# Altium schematic sheet M2_DRV8301_driver.SchDoc
size 594 x 420 mm; SheetNumber: 6; SheetTotal: 9
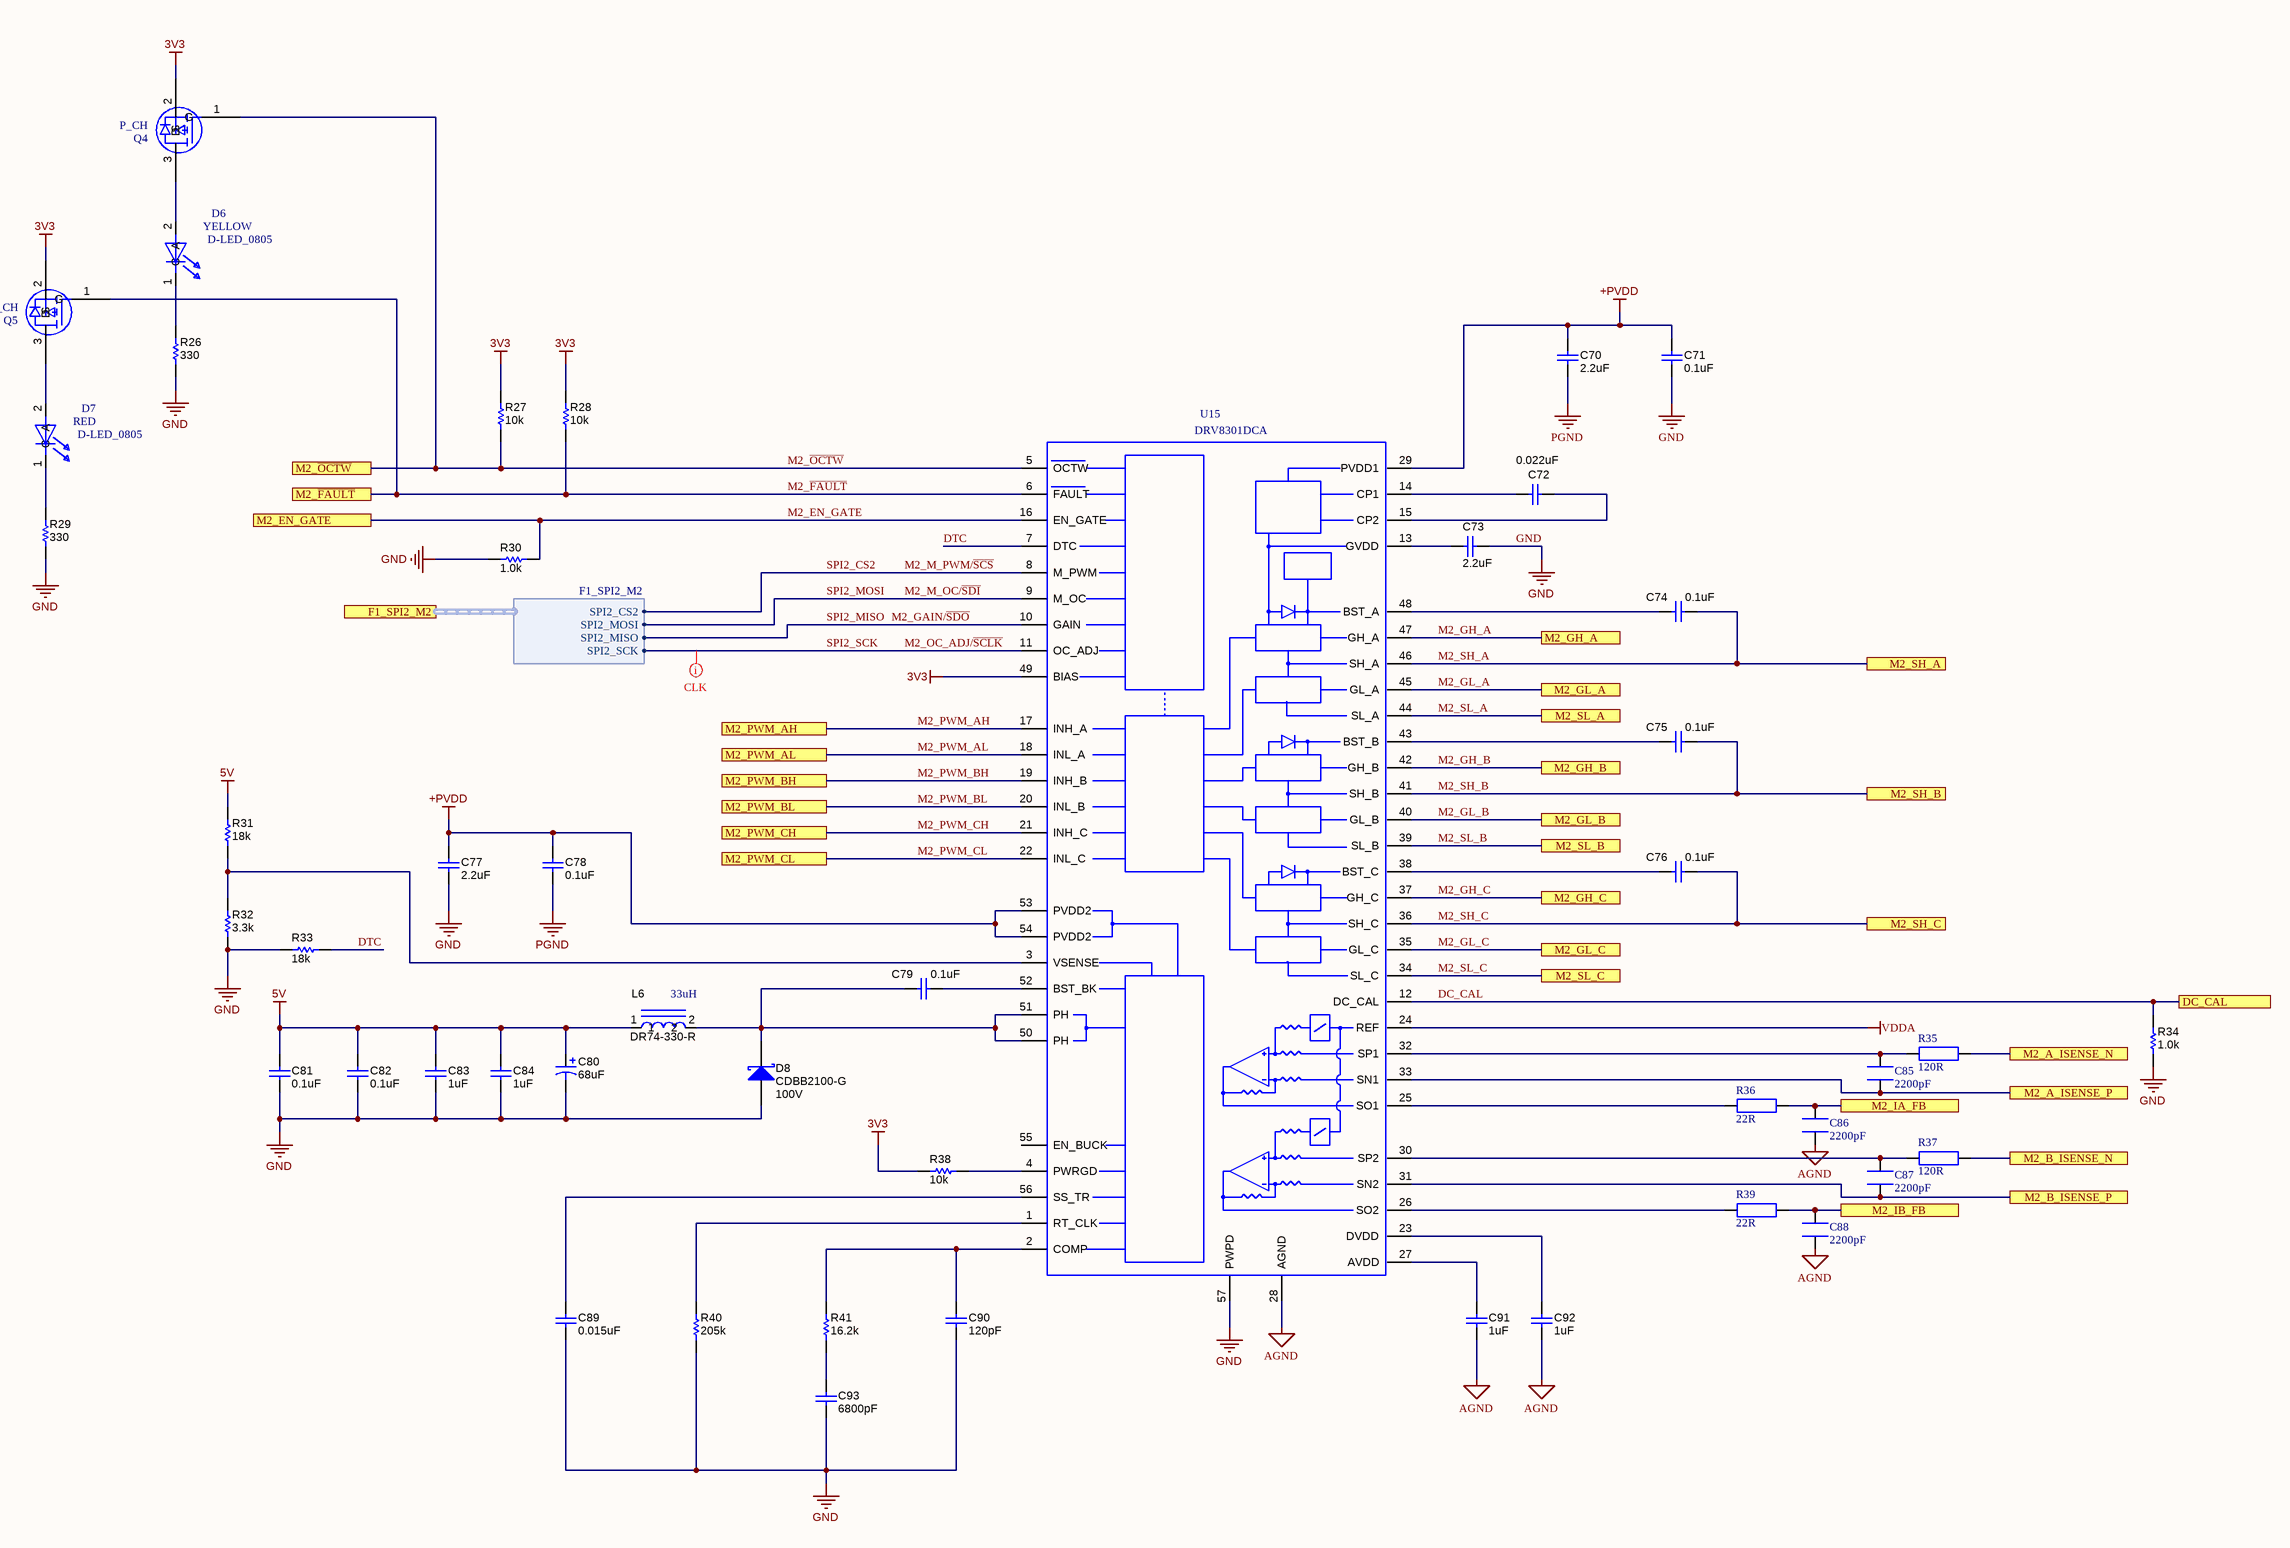
[diagram p0: M2_DRV8301_driver.SchDoc]

## Parts
C70  ValueDisplayed: 2.2uF  [1210L]  (hidden comment: GRM32ER72A225KA35L)
C71  ValueDisplayed: 0.1uF  [0603L]  (hidden comment: GRM188R72A104KA35D)
C72  ValueDisplayed: 0.022uF  [0603L]  (hidden comment: C1608X7R1H223K)
C73  ValueDisplayed: 2.2uF  [0805L]  (hidden comment: GRM219R61E225KA12D)
C74  ValueDisplayed: 0.1uF  [0603L]  (hidden comment: C1608X7R1H104K)
C75  ValueDisplayed: 0.1uF  [0603L]  (hidden comment: C1608X7R1H104K)
C76  ValueDisplayed: 0.1uF  [0603L]  (hidden comment: C1608X7R1H104K)
C77  ValueDisplayed: 2.2uF  [1210L]  (hidden comment: GRM32ER72A225KA35L)
C78  ValueDisplayed: 0.1uF  [0603L]  (hidden comment: GRM188R72A104KA35D)
C79  ValueDisplayed: 0.1uF  [0603L]  (hidden comment: C1608X7R1H104K)
C80  ValueDisplayed: 68uF  [SM_RADIAL_D]  (hidden comment: EEE-FK1E470P)
C81  ValueDisplayed: 0.1uF  [0603L]  (hidden comment: C1608X7R1E104K)
C82  ValueDisplayed: 0.1uF  [0603L]  (hidden comment: C1608X7R1E104K)
C83  ValueDisplayed: 1uF  [0603L]  (hidden comment: C1608X5R1E105K080AC)
C84  ValueDisplayed: 1uF  [0603L]  (hidden comment: C1608X5R1E105K080AC)
C85  2200pF  [CAPC1608X09L]
C86  2200pF  [CAPC1608X09L]
C87  2200pF  [CAPC1608X09L]
C88  2200pF  [CAPC1608X09L]
C89  ValueDisplayed: 0.015uF  [0603L]  (hidden comment: GRM188R71H153KA01D)
C90  ValueDisplayed: 120pF  [0603L]  (hidden comment: GRM1885C1H121JA01D)
C91  ValueDisplayed: 1uF  [0603L]  (hidden comment: GRM188R61E105KA12D)
C92  ValueDisplayed: 1uF  [0603L]  (hidden comment: GRM188R61E105KA12D)
C93  ValueDisplayed: 6800pF  [0603L]  (hidden comment: GRM188R71H682KA01D)
D6  D-LED_0805  value YELLOW  [LED_0805]
D7  D-LED_0805  value RED  [LED_0805]
D8  CDBB2100-G  value 100V  [SMB]
L6  DR74-330-R  value 33uH  [IND_DR74]
Q4  value P_CH  [SOT-23]  (hidden comment: TR_PFET_SOT23)
Q5  value P_CH  [SOT-23]  (hidden comment: TR_PFET_SOT23)
R26  value 330  [0603L]  (hidden comment: CRCW0603330RJNEA)
R27  value 10k  [0603L]  (hidden comment: CRCW060310K0JNEA)
R28  value 10k  [0603L]  (hidden comment: CRCW060310K0JNEA)
R29  value 330  [0603L]  (hidden comment: CRCW0603330RJNEA)
R30  value 1.0k  [0603L]  (hidden comment: CRCW06031K00JNEA)
R31  value 18k  [0603L]  (hidden comment: CRCW060331K6FKEA)
R32  value 3.3k  [0603L]  (hidden comment: RG1608P-103-B-T5)
R33  value 18k  [0603L]  (hidden comment: CRCW060331K6FKEA)
R34  value 1.0k  [0603L]  (hidden comment: CRCW06031K00JNEA)
R35  120R  [RESC1608X55N]
R36  22R  [RESC1608X55N]
R37  120R  [RESC1608X55N]
R38  value 10k  [0603L]  (hidden comment: CRCW060310K0JNEA)
R39  22R  [RESC1608X55N]
R40  value 205k  [0603L]  (hidden comment: CRCW0603205KFKEA)
R41  value 16.2k  [0603L]  (hidden comment: CRCW060316K2FKEA)
U15  DRV8301DCA  [DCA_56P]

## Ports
DC_CAL (see STM32G4_DRV8301_hardware_TOP_V1.0[4C], M1_DRV8301_driver[7D], STM32G4_microcontroller[3B]), F1_SPI2_M2 (harness F1_SPI2_M2, see STM32G4_DRV8301_hardware_TOP_V1.0[4B], STM32F1_microcontroller[6B]), M2_A_ISENSE_N (see STM32G4_DRV8301_hardware_TOP_V1.0[5C], DRV8301_inverter[1F]), M2_A_ISENSE_P (see STM32G4_DRV8301_hardware_TOP_V1.0[5C], DRV8301_inverter[1F]), M2_B_ISENSE_N (see STM32G4_DRV8301_hardware_TOP_V1.0[5C], DRV8301_inverter[4F]), M2_B_ISENSE_P (see STM32G4_DRV8301_hardware_TOP_V1.0[5C], DRV8301_inverter[4F]), M2_EN_GATE (see STM32G4_DRV8301_hardware_TOP_V1.0[4C]), M2_GH_A (see STM32G4_DRV8301_hardware_TOP_V1.0[5B], DRV8301_inverter[2D]), M2_GH_B (see STM32G4_DRV8301_hardware_TOP_V1.0[5B], DRV8301_inverter[4D]), M2_GH_C (see STM32G4_DRV8301_hardware_TOP_V1.0[5C], DRV8301_inverter[6D]), M2_GL_A (see STM32G4_DRV8301_hardware_TOP_V1.0[5B], DRV8301_inverter[2E]), M2_GL_B (see STM32G4_DRV8301_hardware_TOP_V1.0[5B], DRV8301_inverter[4E]), M2_GL_C (see STM32G4_DRV8301_hardware_TOP_V1.0[5C], DRV8301_inverter[6E]), M2_IA_FB (see STM32G4_DRV8301_hardware_TOP_V1.0[4C]), M2_IB_FB (see STM32G4_DRV8301_hardware_TOP_V1.0[4C]), M2_PWM_AH (see STM32G4_DRV8301_hardware_TOP_V1.0[4C]), M2_PWM_AL (see STM32G4_DRV8301_hardware_TOP_V1.0[4C]), M2_PWM_BH (see STM32G4_DRV8301_hardware_TOP_V1.0[4C]), M2_PWM_BL (see STM32G4_DRV8301_hardware_TOP_V1.0[4C]), M2_PWM_CH (see STM32G4_DRV8301_hardware_TOP_V1.0[4C]), M2_PWM_CL (see STM32G4_DRV8301_hardware_TOP_V1.0[4C]), M2_SH_A (see STM32G4_DRV8301_hardware_TOP_V1.0[5B], DRV8301_inverter[2E], DRV8301_inverter[7E]), M2_SH_B (see STM32G4_DRV8301_hardware_TOP_V1.0[5B], DRV8301_inverter[5E], DRV8301_inverter[7E]), M2_SH_C (see STM32G4_DRV8301_hardware_TOP_V1.0[5C], DRV8301_inverter[7D], DRV8301_inverter[7E]), M2_SL_A (see STM32G4_DRV8301_hardware_TOP_V1.0[5B], DRV8301_inverter[2F]), M2_SL_B (see STM32G4_DRV8301_hardware_TOP_V1.0[5B], DRV8301_inverter[5F]), M2_SL_C (see STM32G4_DRV8301_hardware_TOP_V1.0[5C], DRV8301_inverter[7F]), M2_~{FAULT} (see STM32G4_DRV8301_hardware_TOP_V1.0[4B]), M2_~{OCTW} (see STM32G4_DRV8301_hardware_TOP_V1.0[4B])

## Harnesses
F1_SPI2_M2: SPI2_SCK, SPI2_MISO, SPI2_MOSI, SPI2_CS2

## Nets
3V3: Q4.2(S) Q5.2(S) R27.2 R28.2 R38.2 U15.49(BIAS)
5V: C80.1(+) C81.1 C82.1 C83.1 C84.1 L6.1 R31.2
+PVDD: C70.1 C71.1 C77.1 C78.1 U15.29(PVDD1) U15.53(PVDD2) U15.54(PVDD2)
AGND: C86.2 C88.2 C91.2 C92.2 U15.28(AGND)
GND: C71.2 C73.2 C77.2 C80.2(-) C81.2 C82.2 C83.2 C84.2 C89.2 C90.2 C93.2 D8.2(A) R26.1 R29.1 R30.1 R32.1 R33.2 R34.1 R40.1 U15.57(PWPD)
PGND: C70.2 C78.2
VDDA: U15.24(REF)
DC_CAL: R34.2 U15.12(DC_CAL) ; port DC_CAL
DTC: R33.1 U15.7(DTC)
M2_A_ISENSE_N: R35.1 ; port M2_A_ISENSE_N
M2_A_ISENSE_P: C85.2 U15.33(SN1) ; port M2_A_ISENSE_P
M2_B_ISENSE_N: R37.1 ; port M2_B_ISENSE_N
M2_B_ISENSE_P: C87.2 U15.31(SN2) ; port M2_B_ISENSE_P
M2_EN_GATE: R30.2 U15.16(EN_GATE) ; port M2_EN_GATE
M2_~{FAULT}: Q5.1(G) R28.1 U15.6(FAULT) ; port M2_~{FAULT}
M2_GAIN/~{SDO}: U15.10(GAIN) ; port F1_SPI2_M2.SPI2_MISO  [also labelled SPI2_MISO]
M2_GH_A: U15.47(GH_A) ; port M2_GH_A
M2_GH_B: U15.42(GH_B) ; port M2_GH_B
M2_GH_C: U15.37(GH_C) ; port M2_GH_C
M2_GL_A: U15.45(GL_A) ; port M2_GL_A
M2_GL_B: U15.40(GL_B) ; port M2_GL_B
M2_GL_C: U15.35(GL_C) ; port M2_GL_C
M2_IA_FB: C86.1 R36.1 ; port M2_IA_FB
M2_IB_FB: C88.1 R39.1 ; port M2_IB_FB
M2_M_OC/~{SDI}: U15.9(M_OC) ; port F1_SPI2_M2.SPI2_MOSI  [also labelled SPI2_MOSI]
M2_M_PWM/~{SCS}: U15.8(M_PWM) ; port F1_SPI2_M2.SPI2_CS2  [also labelled SPI2_CS2]
M2_~{OCTW}: Q4.1(G) R27.1 U15.5(OCTW) ; port M2_~{OCTW}
M2_OC_ADJ/~{SCLK}: U15.11(OC_ADJ) ; port F1_SPI2_M2.SPI2_SCK  [also labelled SPI2_SCK]
M2_PWM_AH: U15.17(INH_A) ; port M2_PWM_AH
M2_PWM_AL: U15.18(INL_A) ; port M2_PWM_AL
M2_PWM_BH: U15.19(INH_B) ; port M2_PWM_BH
M2_PWM_BL: U15.20(INL_B) ; port M2_PWM_BL
M2_PWM_CH: U15.21(INH_C) ; port M2_PWM_CH
M2_PWM_CL: U15.22(INL_C) ; port M2_PWM_CL
M2_SH_A: C74.2 U15.46(SH_A) ; port M2_SH_A
M2_SH_B: C75.2 U15.41(SH_B) ; port M2_SH_B
M2_SH_C: C76.2 U15.36(SH_C) ; port M2_SH_C
M2_SL_A: U15.44(SL_A) ; port M2_SL_A
M2_SL_B: U15.39(SL_B) ; port M2_SL_B
M2_SL_C: U15.34(SL_C) ; port M2_SL_C
NetC72_1: C72.1 U15.14(CP1)
NetC72_2: C72.2 U15.15(CP2)
NetC73_1: C73.1 U15.13(GVDD)
NetC74_1: C74.1 U15.48(BST_A)
NetC75_1: C75.1 U15.43(BST_B)
NetC76_1: C76.1 U15.38(BST_C)
NetC79_1: C79.1 D8.1(K) L6.2 U15.50(PH) U15.51(PH)
NetC79_2: C79.2 U15.52(BST_BK)
NetC85_1: C85.1 R35.2 U15.32(SP1)
NetC87_1: C87.1 R37.2 U15.30(SP2)
NetC89_1: C89.1 U15.56(SS_TR)
NetC90_1: C90.1 R41.2 U15.2(COMP)
NetC91_1: C91.1 U15.27(AVDD)
NetC92_1: C92.1 U15.23(DVDD)
NetC93_1: C93.1 R41.1
NetD6_1: D6.1(C) R26.2
NetD6_2: D6.2(A) Q4.3(D)
NetD7_1: D7.1(C) R29.2
NetD7_2: D7.2(A) Q5.3(D)
NetR31_1: R31.1 R32.2 U15.3(VSENSE)
NetR36_2: R36.2 U15.25(SO1)
NetR38_1: R38.1 U15.4(PWRGD)
NetR39_2: R39.2 U15.26(SO2)
NetR40_2: R40.2 U15.1(RT_CLK)

Not connected (* = marked no-connect by the designer): U15 55(EN_BUCK)

## Layout directives
mark named CLK: M2_OC_ADJ/~{SCLK}

## Notes on the sheet
- DWG NO:
- REV:
- THIS DOCUMENT AND THE DATA DISCLOSED HEREIN OR
- HEREWITH IS THE PROPERTY OF ALTIUM LIMITED AND MAY
- BE FREELY DISTRIBUTED IN WHOLE. NO RIGHTS ARE
- RESERVED OR EXPRESS OR IMPLIED WARANTEE GIVEN.
- REVISION
- DESCRIPTION
- DATE
- APPROVED
- ENG:
- APPROVALS
- PROJECT
- DSN:
- CHK:
- REFERENCE DOCUMENTS
- PROJECT REVISION:
- TITLE
- DOCUMENT REVISION:
- DESIGN ITEM:
- BOM:
- FAB DWG:
- PCB DWG:
- ASSY DWG:
- SCALE:
- A2
- SIZE
- CAGE CODE
- FILE NAME
- DWG NO.
- SHEET
- OF
- REV

## Library data of the parts
C70 C77 = GRM32ER72A225KA35L: CAP, CERM, 2.2uF, 100V, +/-10%, X7R, 1210; Manufacturer: MuRata; Polarized: N; CompType: Capacitor; U/M: EA; Cap_F: 0.0000022; Tolerance_%: 10; ESR_Ohm: 0.007; Value1: 0.007 ohm; VDC_V: 100; IRMS_A: 4.4; TaMin_C: -55; TaMax_C: 125; Cap_Case: 1210; SymbolVersion: 2008-07-09; Value: 2.2uF; PartNumber: GRM32ER72A225KA35L; PackageReference: 1210; RoHS: Y; Value2: 100V; MountType: SMT; Technology: Ceramic; TempCo: X7R; Published: 2008-06-19; Publisher: Texas Instruments; LatestRevisionDate: 2013-05-24; LatestRevisionNote: Changed publisher; ComponentLink1Description: Datasheet link; ComponentLink1URL: http://search.murata.co.jp/Ceramy/PnsearchViewAction.do?HnOFG=ON&HnNFG=ON&SEL_CNT=50&sLang=en&sKey=GRM32ER72A225KA35L&x=9&y=9&search=startwith; Supplier 1: Digi-Key; Supplier Part Number 1: 490-3385-1-ND; Supplier 2: Mouser; Supplier Part Number 2: 81-GRM32ER72A225KA35; Supplier 3: Farnell; Supplier Part Number 3: 1735547
C71 C78 = GRM188R72A104KA35D: CAP, CERM, 0.1uF, 100V, +/-10%, X7R, 0603; Manufacturer: MuRata; Polarized: N; CompType: Capacitor; U/M: EA; Cap_F: 0.0000001; Tolerance_%: 10; Value1: Unknown; VDC_V: 100; TaMin_C: -55; TaMax_C: 125; Cap_Case: 0603; SymbolVersion: 2008-07-09; Value: 0.1uF; PartNumber: GRM188R72A104KA35D; PackageReference: 0603; RoHS: Y; Value2: 100V; MountType: SMT; Technology: Ceramic; TempCo: X7R; Published: 2008-06-19; Publisher: Texas Instruments; LatestRevisionDate: 2013-05-24; LatestRevisionNote: Changed publisher; ComponentLink1Description: Datasheet link; ComponentLink1URL: http://search.murata.co.jp/Ceramy/PnsearchViewAction.do?HnOFG=ON&HnNFG=ON&SEL_CNT=50&sLang=en&sKey=GRM188R72A104KA35D&x=9&y=9&search=startwith; Supplier 1: Digi-Key; Supplier Part Number 1: 490-3285-1-ND; Supplier 2: Mouser; Supplier Part Number 2: 81-GRM188R72A104KA35; Supplier 3: Farnell; Supplier Part Number 3: 1828921
C72 = C1608X7R1H223K: CAP, CERM, 0.022uF, 50V, +/-10%, X7R, 0603; Manufacturer: TDK; Polarized: N; CompType: Capacitor; U/M: EA; Cap_F: 0.000000022; Tolerance_%: 10; ESR_Ohm: 0.0383; Value1: 0.0383 ohm; VDC_V: 50; TaMin_C: -55; TaMax_C: 125; Cap_Case: 0603; SymbolVersion: 2008-07-09; Value: 0.022uF; PartNumber: C1608X7R1H223K; PackageReference: 0603; RoHS: Y; Value2: 50V; MountType: SMT; Technology: Ceramic; TempCo: X7R; Published: 2008-06-19; Publisher: Texas Instruments; LatestRevisionDate: 2013-05-24; LatestRevisionNote: Changed publisher; ComponentLink1Description: Datasheet link; ComponentLink1URL: http://www.tdk.co.jp/tefe02/e412_c.pdf; Supplier 1: Digi-Key; Supplier Part Number 1: 445-1312-1-ND; Supplier 2: Farnell; Supplier Part Number 2: 1907316
C73 = GRM219R61E225KA12D: CAP, CERM, 2.2uF, 25V, +/-10%, X5R, 0805; Manufacturer: MuRata; Polarized: N; CompType: Capacitor; U/M: EA; Cap_F: 0.0000022; Tolerance_%: 10; ESR_Ohm: 0.006; Value1: 0.006 ohm; VDC_V: 25; TaMin_C: -55; TaMax_C: 85; Cap_Case: 0805; SymbolVersion: 2008-07-09; Value: 2.2uF; PartNumber: GRM219R61E225KA12D; PackageReference: 0805; RoHS: Y; Value2: 25V; MountType: SMT; Technology: Ceramic; TempCo: X5R; Published: 2008-06-19; Publisher: Texas Instruments; LatestRevisionDate: 2013-05-24; LatestRevisionNote: Changed publisher; ComponentLink1Description: Datasheet link; ComponentLink1URL: http://search.murata.co.jp/Ceramy/PnsearchViewAction.do?HnOFG=ON&HnNFG=ON&SEL_CNT=50&sLang=en&sKey=GRM219R61E225KA12D&x=9&y=9&search=startwith; Supplier 1: Digi-Key; Supplier Part Number 1: 490-1701-1-ND; Supplier 2: Mouser; Supplier Part Number 2: 81-GRM219R61E225K; Supplier 3: Farnell; Supplier Part Number 3: 1845749
C74-C76 C79 = C1608X7R1H104K: CAP, CERM, 0.1uF, 50V, +/-10%, X7R, 0603; Manufacturer: TDK; Polarized: N; CompType: Capacitor; U/M: EA; Cap_F: 0.0000001; Tolerance_%: 10; ESR_Ohm: 0.017; Value1: 0.017 ohm; VDC_V: 50; TaMin_C: -55; TaMax_C: 125; Cap_Case: 0603; SymbolVersion: 2008-07-09; Value: 0.1uF; PartNumber: C1608X7R1H104K; PackageReference: 0603; RoHS: Y; Value2: 50V; MountType: SMT; Technology: Ceramic; TempCo: X7R; Published: 2008-06-19; Publisher: Texas Instruments; LatestRevisionDate: 2013-05-24; LatestRevisionNote: Changed publisher; ComponentLink1Description: Datasheet link; ComponentLink1URL: http://www.tdk.co.jp/tefe02/e412_c.pdf; Supplier 1: Digi-Key; Supplier Part Number 1: 445-1314-1-ND; Supplier 2: Farnell; Supplier Part Number 2: 1118182
C80 = EEE-FK1E470P: CAP, AL, 47uF, 25V, +/-20%, 0.36 ohm, SMD; Manufacturer: Panasonic; Polarized: Y; CompType: Capacitor; U/M: EA; Cap_F: 0.000047; Tolerance_%: 20; VDC_V: 25; ESR_Ohm: 0.36; IRMS_A: 0.24; TaMin_C: -55; TaMax_C: 105; Cap_Case: D; SymbolVersion: 2008-07-09; Value: 47uF; PartNumber: EEE-FK1E470P; PackageReference: SMT Radial D; RoHS: Y; Value1: 0.36 ohm; Value2: 25V; MountType: SMT; Technology: AL; Series: FK; Publisher: Texas Instruments; LatestRevisionDate: 2013-05-31; ComponentLink1Description: Datasheet link; ComponentLink1URL: http://www.panasonic.com/industrial/components/pdf/smt_aec_050505.pdf; Supplier 1: Digi-Key; Supplier Part Number 1: PCE3804CT-ND; Supplier 2: Mouser; Supplier Part Number 2: 667-EEE-FK1E470P; Supplier 3: Farnell; Supplier Part Number 3: 9695753
C81 C82 = C1608X7R1E104K: CAP, CERM, 0.1uF, 25V, +/-10%, X7R, 0603; Manufacturer: TDK; Polarized: N; CompType: Capacitor; U/M: EA; Cap_F: 0.0000001; Tolerance_%: 10; ESR_Ohm: 0.017; Value1: 0.017 ohm; VDC_V: 25; TaMin_C: -55; TaMax_C: 125; Cap_Case: 0603; SymbolVersion: 2008-07-09; Value: 0.1uF; PartNumber: C1608X7R1E104K; PackageReference: 0603; RoHS: Y; Value2: 25V; MountType: SMT; Technology: Ceramic; TempCo: X7R; Published: 2008-06-19; Publisher: Texas Instruments; LatestRevisionDate: 2013-05-24; LatestRevisionNote: Changed publisher; ComponentLink1Description: Datasheet link; ComponentLink1URL: http://www.tdk.co.jp/tefe02/e412_c.pdf; Supplier 1: Digi-Key; Supplier Part Number 1: 445-1316-1-ND; Supplier 2: Farnell; Supplier Part Number 2: 1844230
C83 C84 = C1608X5R1E105K080AC: CAP, CERM, 1uF, 25V, +/-10%, X5R, 0603; Manufacturer: TDK; Polarized: N; CompType: Capacitor; U/M: EA; Cap_F: 0.000001; Tolerance_%: 10; Value1: Unknown; VDC_V: 25; TaMin_C: -55; TaMax_C: 85; Cap_Case: 0603; SymbolVersion: 2008-07-09; Value: 1uF; PartNumber: C1608X5R1E105K080AC; PackageReference: 0603; RoHS: Y; Value2: 25V; MountType: SMT; Technology: Ceramic; TempCo: X5R; Published: 2008-06-19; Publisher: Texas Instruments; LatestRevisionDate: 2013-05-24; LatestRevisionNote: Changed publisher; ComponentLink1Description: Datasheet link; ComponentLink1URL: http://product.tdk.com/capacitor/mlcc/en/documents/mlcc_commercial_general_en.pdf; Supplier 1: Digi-Key; Supplier Part Number 1: 445-5146-1-ND; Supplier 2: Newark; Supplier Part Number 2: 90R7677
C85-C88 = GRM1885C1H222JA01D: CAP CER 2200PF 50V NP0 0603; Manufacturer: Murata Electronics North America; Tolerance: ±5%; Temperature Coefficient: C0G, NP0; Supplier 1: Digi-Key; Supplier Part Number 1: 490-1459-1-ND; RoHS: RoHS Compliant; Category: Capacitors; Stock 1: 850589; Pricing 1: 1=0.11, 10=0.08, 25=0.058, 50=0.0434, 100=0.0355, 250=0.02972, 500=0.02536, 1000=0.01992 (USD); Packaging: Cut Tape (CT); Capacitance: 2200pF; Voltage - Rated: 50V; Mounting Type: Surface Mount, MLCC; Operating Temperature: -55°C ~ 125°C; Applications: General Purpose; Ratings: -; Package / Case: 0603 (1608 Metric); Size / Dimension: 0.063" L x 0.031" W (1.60mm x 0.80mm); Height - Seated (Max): -; Thickness (Max): 0.035" (0.90mm); Lead Spacing: -; Features: -; Lead Style: -; ComponentLink1URL: http://www.murata.com/~/media/webrenewal/support/library/catalog/products/capacitor/mlcc/c02e.ashx; ComponentLink1Description: http://www.murata.com/~/media/webrenewal/support/library/catalog/products/capacitor/mlcc/c02e.ashx; Part Status: Active
C89 = GRM188R71H153KA01D: CAP, CERM, 0.015uF, 50V, +/-10%, X7R, 0603; Manufacturer: MuRata; Polarized: N; CompType: Capacitor; U/M: EA; Cap_F: 0.000000015; Tolerance_%: 10; Value1: Unknown; VDC_V: 50; TaMin_C: -55; TaMax_C: 125; Cap_Case: 0603; SymbolVersion: 2008-07-09; Value: 0.015uF; PartNumber: GRM188R71H153KA01D; PackageReference: 0603; RoHS: Y; Value2: 50V; MountType: SMT; Technology: Ceramic; TempCo: X7R; Published: 2008-06-19; Publisher: Texas Instruments; LatestRevisionDate: 2013-05-24; LatestRevisionNote: Changed publisher; ComponentLink1Description: Datasheet link; ComponentLink1URL: http://search.murata.co.jp/Ceramy/PnsearchViewAction.do?HnOFG=ON&HnNFG=ON&SEL_CNT=50&sLang=en&sKey=GRM188R71H153KA01D&x=9&y=9&search=startwith; Supplier 1: Digi-Key; Supplier Part Number 1: 490-1514-1-ND; Supplier 2: Mouser; Supplier Part Number 2: 81-GRM18R71H153KA01D; Supplier 3: Farnell; Supplier Part Number 3: 1828916
C90 = GRM1885C1H121JA01D: CAP, CERM, 120pF, 50V, +/-5%, C0G/NP0, 0603; Manufacturer: MuRata; Polarized: N; CompType: Capacitor; U/M: EA; Cap_F: 0.00000000012; Tolerance_%: 5; Value1: Unknown; VDC_V: 50; TaMin_C: -55; TaMax_C: 125; Cap_Case: 0603; SymbolVersion: 2008-07-09; Value: 120pF; PartNumber: GRM1885C1H121JA01D; PackageReference: 0603; RoHS: Y; Value2: 50V; MountType: SMT; Technology: Ceramic; TempCo: C0G/NP0; Published: 2008-06-19; Publisher: Texas Instruments; LatestRevisionDate: 2013-05-24; LatestRevisionNote: Changed publisher; ComponentLink1Description: Datasheet link; ComponentLink1URL: http://search.murata.co.jp/Ceramy/PnsearchViewAction.do?HnOFG=ON&HnNFG=ON&SEL_CNT=50&sLang=en&sKey=GRM1885C1H121JA01D&x=9&y=9&search=startwith; Supplier 1: Digi-Key; Supplier Part Number 1: 490-1429-1-ND; Supplier 2: Mouser; Supplier Part Number 2: 81-GRM39C121J50; Supplier 3: Farnell; Supplier Part Number 3: 1403555
C91 C92 = GRM188R61E105KA12D: CAP, CERM, 1uF, 25V, +/-10%, X5R, 0603; Manufacturer: MuRata; Polarized: N; CompType: Capacitor; U/M: EA; Cap_F: 0.000001; Tolerance_%: 10; Value1: Unknown; VDC_V: 25; TaMin_C: -55; TaMax_C: 85; Cap_Case: 0603; SymbolVersion: 2008-07-09; Value: 1uF; PartNumber: GRM188R61E105KA12D; PackageReference: 0603; RoHS: Y; Value2: 25V; MountType: SMT; Technology: Ceramic; TempCo: X5R; Published: 2008-06-19; Publisher: Texas Instruments; LatestRevisionDate: 2013-05-24; LatestRevisionNote: Changed publisher; ComponentLink1Description: Datasheet link; ComponentLink1URL: http://search.murata.co.jp/Ceramy/PnsearchViewAction.do?HnOFG=ON&HnNFG=ON&SEL_CNT=50&sLang=en&sKey=GRM188R61E105KA12D&x=9&y=9&search=startwith; Supplier 1: Digi-Key; Supplier Part Number 1: 490-3897-1-ND; Supplier 2: Mouser; Supplier Part Number 2: 81-GRM188R61E105KA12; Supplier 3: Farnell; Supplier Part Number 3: 1828802
C93 = GRM188R71H682KA01D: CAP, CERM, 6800pF, 50V, +/-10%, X7R, 0603; Manufacturer: MuRata; Polarized: N; CompType: Capacitor; U/M: EA; Cap_F: 0.0000000068; Tolerance_%: 10; Value1: Unknown; VDC_V: 50; TaMin_C: -55; TaMax_C: 125; Cap_Case: 0603; SymbolVersion: 2008-07-09; Value: 6800pF; PartNumber: GRM188R71H682KA01D; PackageReference: 0603; RoHS: Y; Value2: 50V; MountType: SMT; Technology: Ceramic; TempCo: X7R; Published: 2008-06-19; Publisher: Texas Instruments; LatestRevisionDate: 2013-05-24; LatestRevisionNote: Changed publisher; ComponentLink1Description: Datasheet link; ComponentLink1URL: http://search.murata.co.jp/Ceramy/PnsearchViewAction.do?HnOFG=ON&HnNFG=ON&SEL_CNT=50&sLang=en&sKey=GRM188R71H682KA01D&x=9&y=9&search=startwith; Supplier 1: Digi-Key; Supplier Part Number 1: 490-1508-1-ND; Supplier 2: Mouser; Supplier Part Number 2: 81-GRM39X682K50D; Supplier 3: Farnell; Supplier Part Number 3: 1403792
D6 = D-LED_0805: LED THIN 585NM YEL DIFF 0805 SMD; PartNumber: SML-LXT0805YW-TR; Manufacturer: Lumex Opto/Components Inc; Vendor Part #: 67-1554-1-ND; PCB DECAL: LED-0805DA; Vendor: DigiKey; ModifyDate: 10/26/2011 10:26:35; ComponentHeight: 0.80 mm; Size: 805
D7 = D-LED_0805: LED THIN660NM SUPRED DIFF0805SMD; PartNumber: SML-LXT0805SRW-TR; Manufacturer: Lumex Opto/Components Inc; Vendor Part #: 67-1555-1-ND; Vendor: DigiKey; ModifyDate: 10/26/2011 10:26:35; PCB DECAL: LED-0805; ComponentHeight: 0.80 mm; Size: 805
D8 = CDBC5100-G: Diode, Schottky, 100V, 2A, SMB; Manufacturer: Comchip Technology; U/M: EA; Vf_V: 0.85; Value2: 0.85V; Io_A: 2; Vr_V: 100; TJmax_C: 125; CompType: Diode; SymbolVersion: 2008-12-08; PartNumber: CDBB2100-G; PackageReference: SMB; Value1: 2A; MountType: SMT; Type: Schottky; RoHS: Y; Published: 2008-06-26; Publisher: Texas Instruments; LatestRevisionDate: 2013-06-04; ComponentLink1Description: Datasheet link; ComponentLink1URL: http://www.comchiptech.com/cms/UserFiles/CDBB220-G%20Thru935254.%20CDBB2100-G%20RevB.pdf; Supplier 1: Digi-Key; Supplier Part Number 1: 641-1109-1-ND; Supplier 2: Mouser; Supplier Part Number 2: 750-CDBB2100-G
L6 = IND_DR74-XXX: INDUCTOR SHIELD PWR 33UH SMD; Manufacturer: Cooper Bussmann; Area: 122500; ComponentLink1URL: \\vette02\pmp_pcb\pcad_pdf's\DR series inductor.pdf; ComponentHeight: 0.175; PackageReference: 0.300" sq; SymbolVersion: 07/31/2009 12:17:29; PartNumber: DR74-330-R; ComponentLink1Description: AEO Datasheet Link
Q4 Q5 = TR_PFET_SOT23: MOSFET P-CH 8V 5.4A SOT23-3; PartNumber: SI2325DS-T1-E3; Manufacturer: Vishey Siliconix; Vendor Part #: S12325DS-T1-E3CT-ND; Vendor: DigiKey; ModifyDate: 11/01/2006 14:12:04; ComponentHeight: 0.043 inch; PCB DECAL: SOT-23; Size: SOT-23
R26 R29 = CRCW0603330RJNEA: RES, 330 ohm, 5%, 0.1W, 0603; Manufacturer: Vishay-Dale; CompType: Resistor; Value_Code: 330R; Tolerance_%: 5; Power_W: 0.1; VDC_V: 75; TempCo: 200 ppm/C; EIA_Code: E24; U/M: EA; SymbolVersion: 2009-05-29; PartNumber: CRCW0603330RJNEA; PackageReference: 0603; RoHS: Y; Res_ohm: 330; Value1: 5%; Value2: 0.1W; MountType: SMT; Technology: Thick Film; Published: 2008-06-26; Publisher: Texas Instruments; LatestRevisionDate: 2013-01-08; ComponentLink1Description: Datasheet link; ComponentLink1URL: http://www.vishay.com/docs/20035/dcrcwe3.pdf; Supplier 1: Digi-Key; Supplier Part Number 1: 541-330GCT-ND; Supplier 2: Mouser; Supplier Part Number 2: 71-CRCW0603J-330-E3; Supplier 3: Farnell; Supplier Part Number 3: 1692522
R27 R28 R38 = CRCW060310K0JNEA: RES, 10k ohm, 5%, 0.1W, 0603; Manufacturer: Vishay-Dale; CompType: Resistor; Res_ohm: 10000; Value_Code: 10k0; Tolerance_%: 5; Power_W: 0.1; VDC_V: 75; TempCo: 200 ppm/C; EIA_Code: E24; U/M: EA; SymbolVersion: 2009-05-29; PartNumber: CRCW060310K0JNEA; PackageReference: 0603; RoHS: Y; Value1: 5%; Value2: 0.1W; MountType: SMT; Technology: Thick Film; Published: 2008-06-26; Publisher: Texas Instruments; LatestRevisionDate: 2013-01-08; ComponentLink1Description: Datasheet link; ComponentLink1URL: http://www.vishay.com/docs/20035/dcrcwe3.pdf; Supplier 1: Digi-Key; Supplier Part Number 1: 541-10KGCT-ND; Supplier 2: Farnell; Supplier Part Number 2: 1562240; Supplier 3: Newark; Supplier Part Number 3: 52K8066
R30 R34 = CRCW06031K00JNEA: RES, 1.0k ohm, 5%, 0.1W, 0603; Manufacturer: Vishay-Dale; CompType: Resistor; Res_ohm: 1000; Value_Code: 1k00; Tolerance_%: 5; Power_W: 0.1; VDC_V: 75; TempCo: 200 ppm/C; EIA_Code: E24; U/M: EA; SymbolVersion: 2009-05-29; PartNumber: CRCW06031K00JNEA; PackageReference: 0603; RoHS: Y; Value1: 5%; Value2: 0.1W; MountType: SMT; Technology: Thick Film; Published: 2008-06-26; Publisher: Texas Instruments; LatestRevisionDate: 2013-01-08; ComponentLink1Description: Datasheet link; ComponentLink1URL: http://www.vishay.com/docs/20035/dcrcwe3.pdf; Supplier 1: Digi-Key; Supplier Part Number 1: 541-1.0KGCT-ND; Supplier 2: Farnell; Supplier Part Number 2: 1652851; Supplier 3: Newark; Supplier Part Number 3: 59M6750
R31 R33 = CRCW060331K6FKEA: RES, 18k ohm, 1%, 0.1W, 0603; Manufacturer: Vishay-Dale; CompType: Resistor; Res_ohm: 31600; Value_Code: 31k6; Tolerance_%: 1; Power_W: 0.1; VDC_V: 75; TempCo: 100 ppm/C; EIA_Code: E96; U/M: EA; SymbolVersion: 2009-05-29; PartNumber: CRCW060331K6FKEA; PackageReference: 0603; RoHS: Y; Value1: 1%; Value2: 0.1W; MountType: SMT; Technology: Thick Film; Published: 2008-06-26; Publisher: Texas Instruments; LatestRevisionDate: 2013-01-08; ComponentLink1Description: Datasheet link; ComponentLink1URL: http://www.vishay.com/docs/20035/dcrcwe3.pdf; Supplier 1: Digi-Key; Supplier Part Number 1: 541-31.6KHCT-ND; Supplier 2: Mouser; Supplier Part Number 2: 71-CRCW0603-31.6K-E3; Supplier 3: Farnell; Supplier Part Number 3: 1151933
R32 = RG1608P-103-B-T5: RES, 3.3k ohm, 0.1%, 0.1W, 0603; Manufacturer: Susumu Co Ltd; CompType: Resistor; Res_ohm: 10000; Value_Code: 10k0; Tolerance_%: 0.1; VDC_V: 75; TempCo: 25 ppm/C; EIA_Code: E192; U/M: EA; SymbolVersion: 2009-05-29; PartNumber: RG1608P-103-B-T5; PackageReference: 0603; RoHS: Y; Value1: 0.1%; Power_W: 0.1; Value2: 0.1W; MountType: SMT; Technology: Metal Film; Published: 2008-06-26; Publisher: Texas Instruments; LatestRevisionDate: 2013-01-08; ComponentLink1Description: Datasheet link; ComponentLink1URL: http://www.susumu.co.jp/english/pdf/products-j01-01.pdf; Supplier 1: Digi-Key; Supplier Part Number 1: RG16P10.0KBCT-ND; Supplier 2: Mouser; Supplier Part Number 2: 754-RG1608P-103-B-T5; Supplier 3: Farnell; Supplier Part Number 3: 1797079
R35 R37 = RC0603FR-07120RL: RES SMD 120 OHM 1% 1/10W 0603; Manufacturer: Yageo; Resistance (Ohms): 120; Power (Watts): 0.1W, 1/10W; Temperature Coefficient: ±100ppm/°C; Supplier 1: Digi-Key; Supplier Part Number 1: 311-120HRCT-ND; Manufacturer Part Number: RC0603FR-07120RL; RoHS: RoHS Compliant; Category: Resistors; Stock 1: 1545282; Pricing 1: 1=0.1, 10=0.014, 25=0.01, 100=0.0057, 250=0.00436, 500=0.00348, 1000=0.00257, 2500=0.00223 (USD); Packaging: Cut Tape (CT); Tolerance: ±1%; Composition: Thick Film; Features: Moisture Resistant; Operating Temperature: -55°C ~ 155°C; Package / Case: 0603 (1608 Metric); Supplier Device Package: 0603; Size / Dimension: 0.063" L x 0.031" W (1.60mm x 0.80mm); Height: 0.022" (0.55mm); Number of Terminations: 2; ComponentLink1URL: http://www.yageo.com/documents/recent/PYu-RC_Group_51_RoHS_L_04.pdf; ComponentLink1Description: http://www.yageo.com/documents/recent/PYu-RC_Group_51_RoHS_L_04.pdf
R36 R39 = RC0603FR-0722RL: RES SMD 22 OHM 1% 1/10W 0603; Manufacturer: Yageo; Resistance (Ohms): 22; Power (Watts): 0.1W, 1/10W; Temperature Coefficient: ±100ppm/°C; Supplier 1: Digi-Key; Supplier Part Number 1: 311-22.0HRCT-ND; Manufacturer Part Number: RC0603FR-0722RL; RoHS: RoHS Compliant; Category: Resistors; Stock 1: 575303; Pricing 1: 1=0.1, 10=0.014, 25=0.01, 100=0.0057, 250=0.00436, 500=0.00348, 1000=0.00257, 2500=0.00223 (USD); Packaging: Cut Tape (CT); Tolerance: ±1%; Composition: Thick Film; Features: Moisture Resistant; Operating Temperature: -55°C ~ 155°C; Package / Case: 0603 (1608 Metric); Supplier Device Package: 0603; Size / Dimension: 0.063" L x 0.031" W (1.60mm x 0.80mm); Height: 0.022" (0.55mm); Number of Terminations: 2; ComponentLink1URL: http://www.yageo.com/documents/recent/PYu-RC_Group_51_RoHS_L_04.pdf; ComponentLink1Description: http://www.yageo.com/documents/recent/PYu-RC_Group_51_RoHS_L_04.pdf
R40 = CRCW0603205KFKEA: RES, 205k ohm, 1%, 0.1W, 0603; Manufacturer: Vishay-Dale; CompType: Resistor; Res_ohm: 205000; Tolerance_%: 1; Power_W: 0.1; VDC_V: 75; TempCo: 100 ppm/C; EIA_Code: E96; U/M: EA; SymbolVersion: 2009-05-29; PartNumber: CRCW0603205KFKEA; PackageReference: 0603; RoHS: Y; Value_Code: 205k; Value1: 1%; Value2: 0.1W; MountType: SMT; Technology: Thick Film; Published: 2008-06-26; Publisher: Texas Instruments; LatestRevisionDate: 2013-01-08; ComponentLink1Description: Datasheet link; ComponentLink1URL: http://www.vishay.com/docs/20035/dcrcwe3.pdf; Supplier 1: Digi-Key; Supplier Part Number 1: 541-205KHCT-ND; Supplier 2: Mouser; Supplier Part Number 2: 71-CRCW0603-205K-E3; Supplier 3: Farnell; Supplier Part Number 3: 1151818
R41 = CRCW060316K2FKEA: RES, 16.2k ohm, 1%, 0.1W, 0603; Manufacturer: Vishay-Dale; CompType: Resistor; Res_ohm: 16200; Value_Code: 16k2; Tolerance_%: 1; Power_W: 0.1; VDC_V: 75; TempCo: 100 ppm/C; EIA_Code: E96; U/M: EA; SymbolVersion: 2009-05-29; PartNumber: CRCW060316K2FKEA; PackageReference: 0603; RoHS: Y; Value1: 1%; Value2: 0.1W; MountType: SMT; Technology: Thick Film; Published: 2008-06-26; Publisher: Texas Instruments; LatestRevisionDate: 2013-01-08; ComponentLink1Description: Datasheet link; ComponentLink1URL: http://www.vishay.com/docs/20035/dcrcwe3.pdf; Supplier 1: Digi-Key; Supplier Part Number 1: 541-16.2KHCT-ND; Supplier 2: Mouser; Supplier Part Number 2: 71-CRCW0603-16.2K-E3; Supplier 3: Farnell; Supplier Part Number 3: 1151719
U15 = DRV8302DCA_ERIC: IC, 3 Phase Pre-Driver with Dual Current Shunt Amplifiers and Buck Regulator-Hardware Controlled; Manufacturer: Texas Instruments; Area: 154.44 mm; Vendor: Supplied; Value: DRV8301DCA; ModifyDate: 05/02/2012 07:50:13; PartNumber: DRV8301DCA; Size: HTSSOP; PCB DECAL: DCA_56P; Vendor Part #: Supplied